# Altium project C210 Rev_D.PrjPcb (part 2 of 5)

## Sheet C210_0003_SARA_Module.SchDoc: C210_0003_SARA_Module
size B; Date: 2/26/2021; CompanyName: U-blox; DrawnBy: EMOO; Engineer: EMOO; Organization: U-blox; Address1: 2601 25th St. SE; Address2: Salem, OR 97302; SheetNumber: 3; SheetTotal: 7; Website: www.u-blox.com; SheetSize: B; SheetTitle: C-210 SARA Module
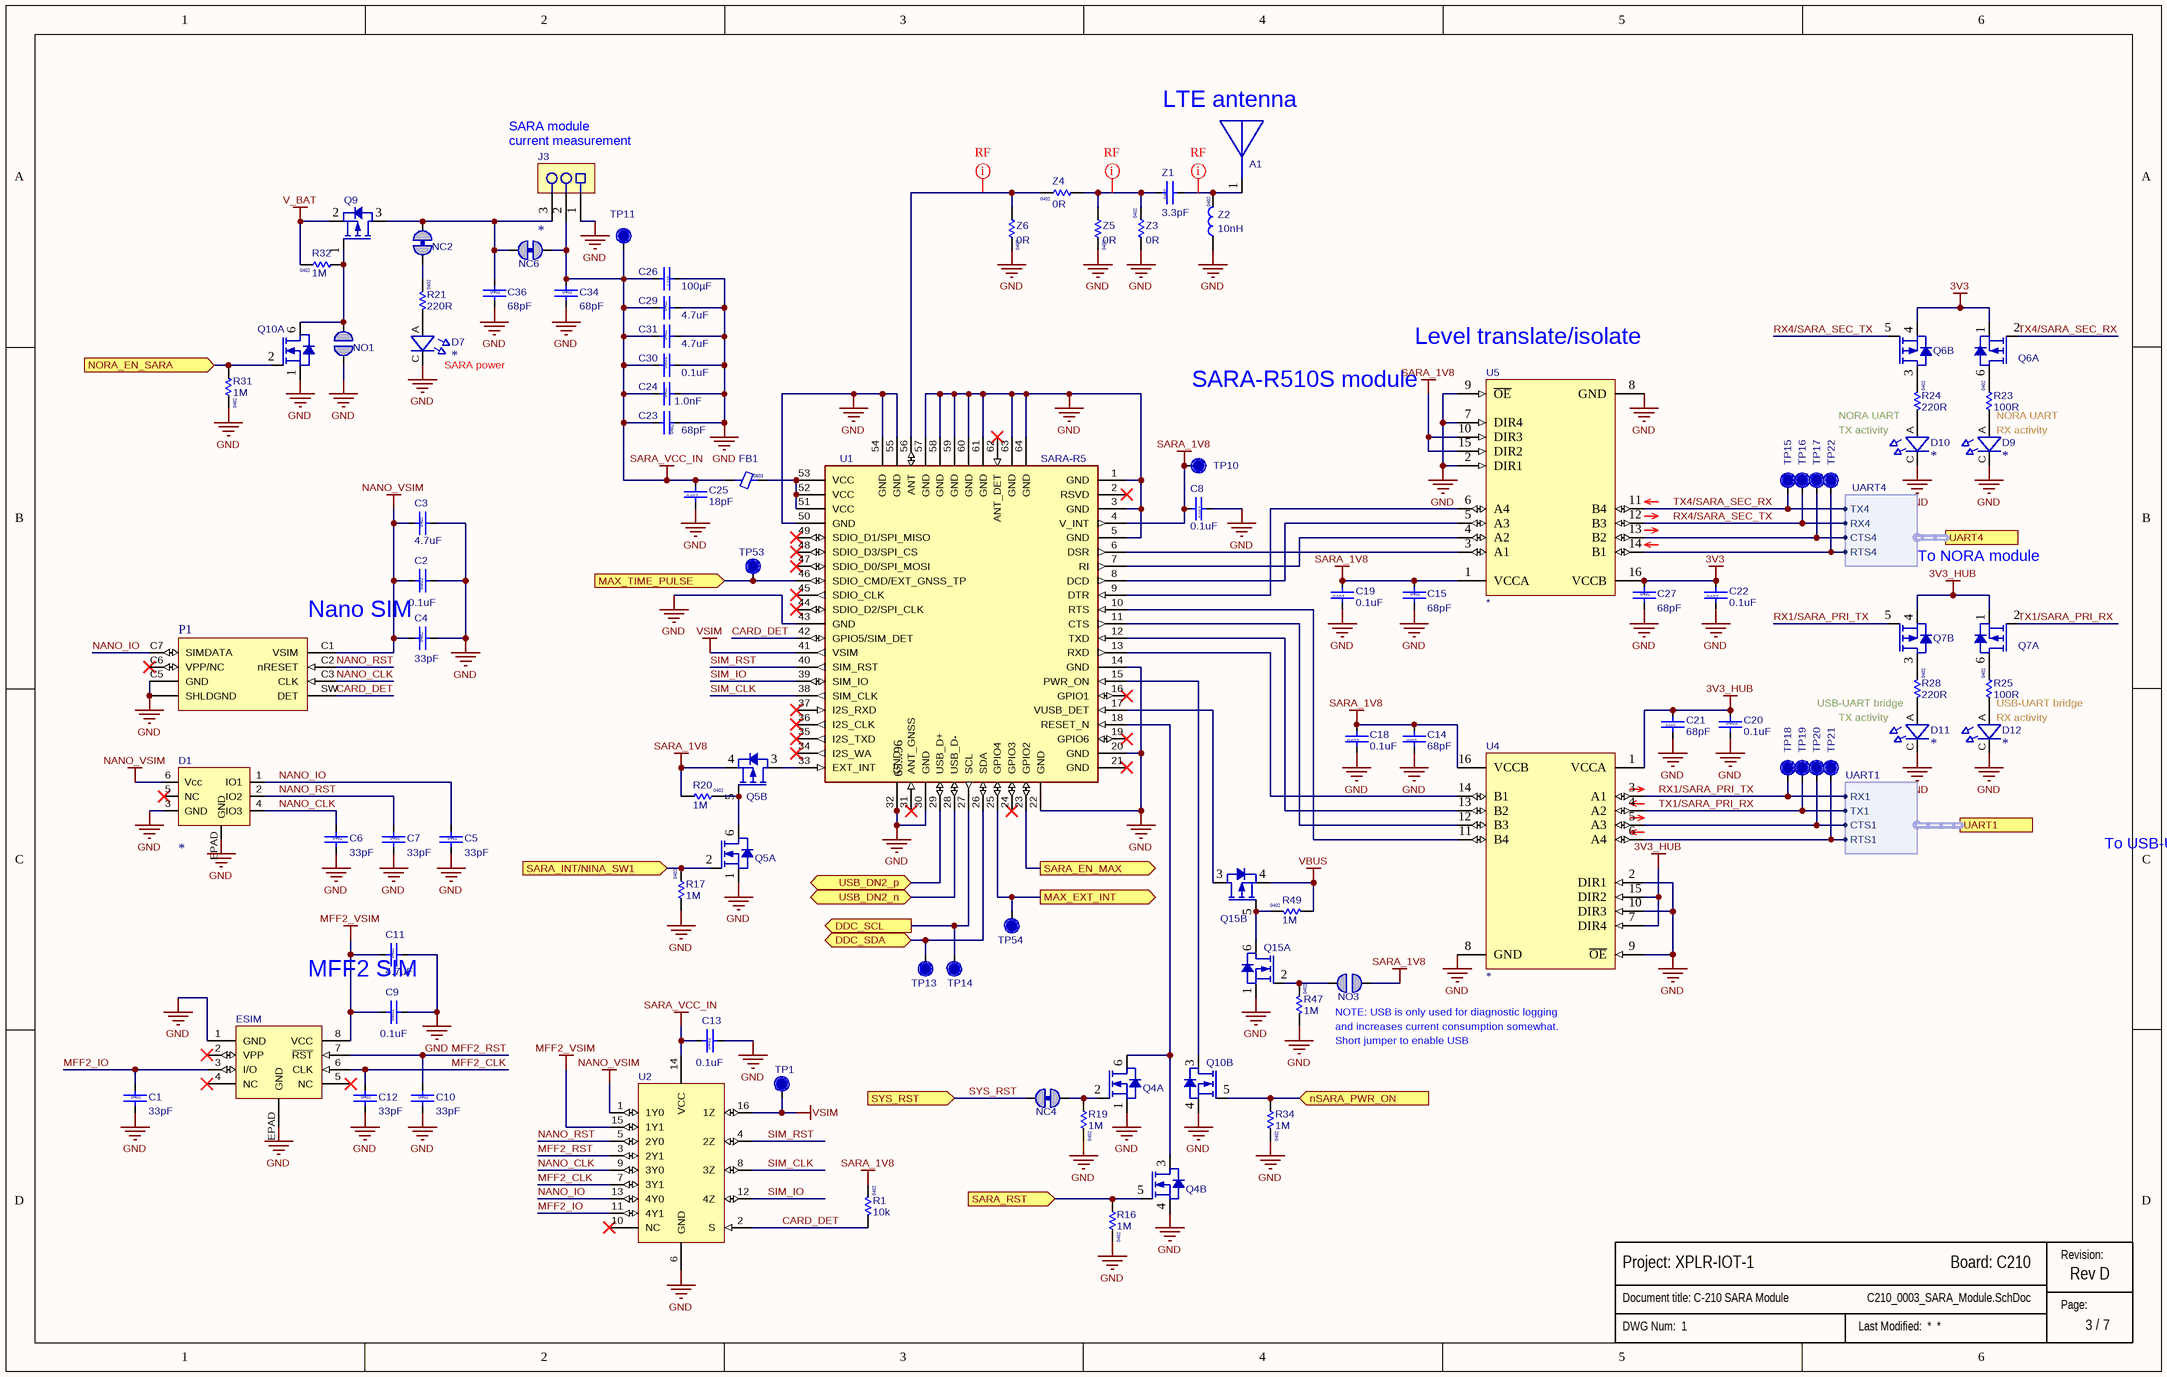
[diagram p2: C210_0003_SARA_Module.SchDoc]

### Parts
(Parts that share a designator on the sheet are numbered #1, #2 ... from top to bottom, then left to right.)
?#4  (no value)  (graphical)
A1  PCS.66.A  [PCS.66.A]  (value not drawn)
C1  value 33pF  Size: 0402  [Cap 0402 HD]
C2  value 0.1uF  Size: 0402  [Cap 0402 HD]  (hidden comment: 120-000160.1uF)
C3  value 4.7uF  Size: 0402  [Cap 0402 HD]
C4  value 33pF  Size: 0402  [Cap 0402 HD]
C5  value 33pF  Size: 0402  [Cap 0402 HD]
C6  value 33pF  Size: 0402  [Cap 0402 HD]
C7  value 33pF  Size: 0402  [Cap 0402 HD]
C8  value 0.1uF  Size: 0402  [Cap 0402 HD]  (hidden comment: 120-000160.1uF)
C9  value 0.1uF  Size: 0402  [Cap 0402 HD]  (hidden comment: 120-000160.1uF)
C10  value 33pF  Size: 0402  [Cap 0402 HD]
C11  value 4.7uF  Size: 0402  [Cap 0402 HD]
C12  value 33pF  Size: 0402  [Cap 0402 HD]
C13  value 0.1uF  Size: 0402  [Cap 0402 HD]  (hidden comment: 120-000160.1uF)
C14  value 68pF  Size: 0402  [Cap 0402 HD]
C15  value 68pF  Size: 0402  [Cap 0402 HD]
C18  value 0.1uF  Size: 0402  [Cap 0402 HD]  (hidden comment: 120-000160.1uF)
C19  value 0.1uF  Size: 0402  [Cap 0402 HD]  (hidden comment: 120-000160.1uF)
C20  value 0.1uF  Size: 0402  [Cap 0402 HD]  (hidden comment: 120-000160.1uF)
C21  value 68pF  Size: 0402  [Cap 0402 HD]
C22  value 0.1uF  Size: 0402  [Cap 0402 HD]  (hidden comment: 120-000160.1uF)
C23  value 68pF  Size: 0402  [Cap 0402 HD]
C24  value 1.0nF  Size: 0402  [Cap 0402 HD]
C25  value 18pF  Size: 0402  [Cap 0402 HD]
C26  value 100µF  Size: 1210  [Cap 1210]
C27  value 68pF  Size: 0402  [Cap 0402 HD]
C29  value 4.7uF  Size: 0402  [Cap 0402 HD]
C30  value 0.1uF  Size: 0402  [Cap 0402 HD]  (hidden comment: 120-000160.1uF)
C31  value 4.7uF  Size: 0402  [Cap 0402 HD]
C34  value 68pF  Size: 0402  [Cap 0402 HD]
C36  value 68pF  Size: 0402  [Cap 0402 HD]
D1  (no value)  [TPD3E001DRSR]
D7  (no value)  [LTST-C190EKT]
D9  (no value)  [LTST-C190YKT]
D10  (no value)  [LTST-C190KGKT]
D11  (no value)  [LTST-C190KGKT]
D12  (no value)  [LTST-C190YKT]
ESIM  (no value)  [MFF2 SIM]
FB1  Size: 0603  [BLM18EG221SN1]
J3  (no value)  [HDR-0.1P-3Pin-1Row-SMT]
NC2  Solderbridge-ShortDNP  [Solderbridge-Short]  (value not drawn)  (net tie, no BOM)
NC4  Solderbridge-ShortDNP  [Solderbridge-Short]  (value not drawn)  (net tie, no BOM)
NC6  Solderbridge-ShortDNP  [Solderbridge-Short]  (value not drawn)  (net tie, no BOM)
NO1  Solderbridge-OpenDNP  [Solderbridge-Open]  (value not drawn)  (no BOM)
NO3  Solderbridge-OpenDNP  [Solderbridge-Open]  (value not drawn)  (no BOM)
P1  (no value)  [G85D1160022HHR]
Q4  (no value)  [SOT-563]  (parts A,B of 2)
Q5  (no value)  [SOT-563]  (parts A,B of 2)
Q6  (no value)  [FDY2000PZ]  (parts A,B of 2)
Q7  (no value)  [FDY2000PZ]  (parts A,B of 2)
Q9  (no value)  [SOT-23]
Q10  (no value)  [SOT-563]  (parts A,B of 2)
Q15  (no value)  [SOT-563]  (parts A,B of 2)
R1  value 10k  Size: 0402  [RES 0402 HD]
R16  value 1M  Size: 0402  [RES 0402 HD]
R17  value 1M  Size: 0402  [RES 0402 HD]
R19  value 1M  Size: 0402  [RES 0402 HD]
R20  value 1M  Size: 0402  [RES 0402 HD]
R21  value 220R  Size: 0402  [RES 0402 HD]
R23  value 100R  Size: 0402  [RES 0402 HD]
R24  value 220R  Size: 0402  [RES 0402 HD]
R25  value 100R  Size: 0402  [RES 0402 HD]
R28  value 220R  Size: 0402  [RES 0402 HD]
R31  value 1M  Size: 0402  [RES 0402 HD]
R32  value 1M  Size: 0402  [RES 0402 HD]
R34  value 1M  Size: 0402  [RES 0402 HD]
R47  value 1M  Size: 0402  [RES 0402 HD]
R49  value 1M  Size: 0402  [RES 0402 HD]
TP1  TP  [TP12R]  (value not drawn)  (no BOM)
TP10  TP  [TP12R]  (value not drawn)  (no BOM)
TP11  TP  [TP12R]  (value not drawn)  (no BOM)
TP13  TP  [TP12R]  (value not drawn)  (no BOM)
TP14  TP  [TP12R]  (value not drawn)  (no BOM)
TP15  TP  [TP12R]  (value not drawn)  (no BOM)
TP16  TP  [TP12R]  (value not drawn)  (no BOM)
TP17  TP  [TP12R]  (value not drawn)  (no BOM)
TP18  TP  [TP12R]  (value not drawn)  (no BOM)
TP19  TP  [TP12R]  (value not drawn)  (no BOM)
TP20  TP  [TP12R]  (value not drawn)  (no BOM)
TP21  TP  [TP12R]  (value not drawn)  (no BOM)
TP22  TP  [TP12R]  (value not drawn)  (no BOM)
TP53  TP  [TP12R]  (value not drawn)  (no BOM)
TP54  TP  [TP12R]  (value not drawn)  (no BOM)
U1  SARA-R5  [SARA-XX]
U2  (no value)  [XQFN-16]
U4  (no value)  [QFN0.5P2x6-16Pin_W-Pad]
U5  (no value)  [QFN0.5P2x6-16Pin_W-Pad]
Z1  value 3.3pF  Size: 0402  [Cap 0402 HD]
Z2  value 10nH  Size: 0402  [IND 0402]
Z3  value 0R  Size: 0402  [RES 0402 HD]
Z4  value 0R  Size: 0402  [RES 0402 HD]
Z5  value 0R  Size: 0402  [RES 0402 HD]
Z6  value 0R  Size: 0402  [RES 0402 HD]

### Ports
DDC_SCL (out), DDC_SDA (bidir), MAX_EXT_INT (out), MAX_TIME_PULSE (in), NORA_EN_SARA (in), nSARA_PWR_ON (in), SARA_EN_MAX (out), SARA_INT/NINA_SW1 (in), SARA_RST (in), SYS_RST (in), UART1 (harness UART1), UART4 (harness UART4), USB_DN2_n (bidir), USB_DN2_p (bidir)

### Harnesses
UART4: TX4, RX4, RTS4, CTS4
UART1: TX1, RX1, RTS1, CTS1

### Nets
3V3: C22.2 C27.1 Q6.1(S1) Q6.4(S2) U5.16(VCCB)
3V3_HUB: C20.1 C21.2 Q7.1(S1) Q7.4(S2) U4.1(VCCA) U4.7(DIR4) U4.15(DIR2)
GND: C1.2 C2.2 C3.2 C4.2 C5.2 C6.2 C7.2 C8.1 C9.2 C10.2 C11.2 C12.2 C13.2 C14.1 C15.2 C18.1 C19.1 C20.2 C21.1 C22.1 C23.1 C24.2 C25.1 C26.1 C27.2 C29.2 C30.2 C31.2 C34.2 C36.2 D1.3(GND) D1.EPAD(GND) D7.C(Cathode) D9.C(Cathode) D10.C(Cathode) D11.C(Cathode) D12.C(Cathode) ESIM.1(GND) ESIM.EPAD(GND) J3.1 NO1.2 P1.C5(GND) P1.MP(SHLDGND) Q4.1(S1) Q4.4(S2) Q5.1(S1) Q10.1(S1) Q10.4(S2) Q15.1(S1) R16.2 R17.1 R19.2 R31.2 R34.2 R47.1 U1.1(GND) U1.3(GND) U1.5(GND) U1.14(GND) U1.20(GND) U1.22(GND) U1.30(GND) U1.32(GND) U1.43(GND) U1.50(GND) U1.54(GND) U1.55(GND) U1.57(GND) U1.58(GND) U1.59(GND) U1.60(GND) U1.61(GND) U1.63(GND) U1.64(GND) U1.65(GND) U1.66(GND) U1.67(GND) U1.68(GND) U1.69(GND) U1.70(GND) U1.71(GND) U1.72(GND) U1.73(GND) U1.74(GND) U1.75(GND) U1.76(GND) U1.77(GND) U1.78(GND) U1.79(GND) U1.80(GND) U1.81(GND) U1.82(GND) U1.83(GND) U1.84(GND) U1.85(GND) U1.86(GND) U1.87(GND) U1.88(GND) U1.89(GND) U1.90(GND) U1.91(GND) U1.92(GND) U1.93(GND) U1.94(GND) U1.95(GND) U1.96(GND) U2.6(GND) U4.2(DIR1) U4.8(GND) U4.9(~{OE}) U4.10(DIR3) U5.2(DIR1) U5.7(DIR4) U5.8(GND) U5.9(~{OE}) Z2.1 Z3.1 Z5.2 Z6.2
MFF2_VSIM: C9.1 C11.1 ESIM.8(VCC) U2.15(1Y1)
NANO_VSIM: C2.1 C3.1 C4.1 D1.6(Vcc) P1.C1(VSIM) U2.1(1Y0)
SARA_1V8: C8.2 C14.2 C15.1 C18.2 C19.2 NO3.2 Q5.4(S2) R1.2 R20.1 TP10.1 U1.4(V_INT) U4.16(VCCB) U5.1(VCCA) U5.10(DIR3) U5.15(DIR2)
SARA_VCC_IN: C13.1 C23.2 C24.1 C25.2 C26.2 C29.1 C30.1 C31.1 C34.1 FB1.1 J3.2 NC6.1 TP11.1 U2.14(VCC)
V_BAT: Q9.2(S) R32.2
VBUS: Q15.4(S2) R49.1
VSIM: TP1.1 U1.41(VSIM) U2.16(1Z)
CARD_DET: P1.SW(DET) R1.1 U1.42(GPIO5/SIM_DET) U2.2(S)
CTS4: TP17.1 U5.13(B2) ; port UART4.CTS4
MFF2_CLK: C12.1 ESIM.6(CLK) U2.7(3Y1)
MFF2_IO: C1.1 ESIM.3(I/O) U2.11(4Y1)
MFF2_RST: C10.1 ESIM.7(~{RST}) U2.3(2Y1)
NANO_CLK: C6.1 D1.4(IO3) P1.C3(CLK) U2.9(3Y0)
NANO_IO: C5.1 D1.1(IO1) P1.C7(SIMDATA) U2.13(4Y0)
NANO_RST: C7.1 D1.2(IO2) P1.C2(nRESET) U2.5(2Y0)
RTS4: TP22.1 U5.14(B1) ; port UART4.RTS4
RX1/SARA_PRI_TX: Q7.5(G2) TP18.1 U4.3(A1) ; port UART1.RX1
RX4/SARA_SEC_TX: Q6.5(G2) TP16.1 U5.12(B3) ; port UART4.RX4  [project net RX4]
SIM_CLK: U1.38(SIM_CLK) U2.8(3Z)
SIM_IO: U1.39(SIM_IO) U2.12(4Z)
SIM_RST: U1.40(SIM_RST) U2.4(2Z)
SYS_RST: NC4.2 ; port SYS_RST
TX1/SARA_PRI_RX: Q7.2(G1) TP19.1 U4.4(A2) ; port UART1.TX1
TX4/SARA_SEC_RX: Q6.2(G1) TP15.1 U5.11(B4) ; port UART4.TX4  [project net TX4]
USB_DN2_n: U1.28(USB_D-) ; port USB_DN2_n
USB_DN2_p: U1.29(USB_D+) ; port USB_DN2_p
NetA1_1: A1.1 Z1.2 Z2.2
NetC36_1: C36.1 J3.3 NC2.1 NC6.2 Q9.3(D)
NetD7_A: D7.A(Anode) R21.1
NetD9_A: D9.A(Anode) R23.1
NetD10_A: D10.A(Anode) R24.1
NetD11_A: D11.A(Anode) R28.1
NetD12_A: D12.A(Anode) R25.1
NetFB1_2: FB1.2 U1.51(VCC) U1.52(VCC) U1.53(VCC)
NetNC2_2: NC2.2 R21.2
NetNC4_1: NC4.1 Q4.2(G1) R19.1
NetNO1_1: NO1.1 Q9.1(G) Q10.6(D1) R32.1
NetNO3_1: NO3.1 Q15.2(G1) R47.2
NetQ1_2: Q5.2(G1) R17.2 ; port SARA_INT/NINA_SW1
NetQ4_3: Q4.3(D2) Q4.6(D1) U1.18(RESET_N)
NetQ4_5: Q4.5(G2) R16.1 ; port SARA_RST
NetQ5_3: Q5.3(D2) U1.33(EXT_INT)
NetQ5_5: Q5.5(G2) Q5.6(D1) R20.2
NetQ6_3: Q6.3(D2) R24.2
NetQ6_6: Q6.6(D1) R23.2
NetQ7_3: Q7.3(D2) R28.2
NetQ7_6: Q7.6(D1) R25.2
NetQ10_2: Q10.2(G1) R31.1 ; port NORA_EN_SARA
NetQ10_3: Q10.3(D2) U1.15(PWR_ON)
NetQ10_5: Q10.5(G2) R34.1 ; port nSARA_PWR_ON
NetQ15_3: Q15.3(D2) U1.17(VUSB_DET)
NetQ15_5: Q15.5(G2) Q15.6(D1) R49.2
NetQ27_2: U1.23(GPIO2) ; port SARA_EN_MAX
NetR18_2: TP53.1 U1.46(SDIO_CMD/EXT_GNSS_TP) ; port MAX_TIME_PULSE
NetTP13_1: TP13.1 U1.26(SDA) ; port DDC_SDA
NetTP14_1: TP14.1 U1.27(SCL) ; port DDC_SCL
NetTP20_1: TP20.1 U4.5(A3) ; port UART1.CTS1
NetTP21_1: TP21.1 U4.6(A4) ; port UART1.RTS1
NetTP54_1: TP54.1 U1.25(GPIO4) ; port MAX_EXT_INT
NetU1_6: U1.6(DSR) U5.3(A1)
NetU1_7: U1.7(RI) U5.4(A2)
NetU1_8: U1.8(DCD) U5.5(A3)
NetU1_9: U1.9(DTR) U5.6(A4)
NetU1_10: U1.10(RTS) U4.11(B4)
NetU1_11: U1.11(CTS) U4.12(B3)
NetU1_12: U1.12(TXD) U4.13(B2)
NetU1_13: U1.13(RXD) U4.14(B1)
NetU1_56: U1.56(ANT) Z4.2 Z6.1
NetZ1_1: Z1.1 Z3.2 Z4.1 Z5.1

Not connected (* = marked no-connect by the designer): D1 5(NC)*; ESIM 2(VPP)* 4(NC)* 5(NC)*; P1 C6(VPP/NC)*; U1 2(RSVD)* 16(GPIO1)* 19(GPIO6)* 21(GND)* 24(GPIO3)* 31(ANT_GNSS)* 34(I2S_WA)* 35(I2S_TXD)* 36(I2S_CLK)* 37(I2S_RXD)* 44(SDIO_D2/SPI_CLK)* 45(SDIO_CLK)* 47(SDIO_D0/SPI_MOSI)* 48(SDIO_D3/SPI_CS)* 49(SDIO_D1/SPI_MISO)* 62(ANT_DET)*; U2 10(NC)*

### Layout directives
net class RF: NetA1_1, NetU1_56, NetZ1_1

### Notes on the sheet
- LTE antenna
- SARA module
- (near J3) current measurement
- (near D7) SARA power
- SARA-R510S module
- (near U5) Level translate/isolate
- TX activity
- NORA UART
- (near D9) RX activity
- (near R23) NORA UART
- To NORA module
- (near P1) Nano SIM
- USB-UART bridge
- (near D12) RX activity
- (near R25) USB-UART bridge
- To USB-UART bridge
- MFF2 SIM
- NOTE: USB is only used for diagnostic logging
- and increases current consumption somewhat.
- Short jumper to enable USB
- Revision:
- Page:
- (in symbol SARA-R5) 65...96

### Library data of the parts
?#4 = Sub_Title_Block: as ?#3 on sheet C210_0002_NORA_Module
A1 = PCS.66.A: RF Passive, Antenna, LTE, 600-6000MHz, Monopole; Manufacturer 1: Taoglas; Body Size: 33mm x 25mm; Item Phase: Unreleased; MFG Package: Custom; RF Freq: 698-2700 MHz; SMT Pitch: None; Use in new designs: Yes; Part Number: PCS.66.A; Manufacturer Part Number 1: PCS.66.A; Height: 1.6mm; Max Operating Temp: 85; Min Operating Temp: -40; Pins: 5; Revision: None; Size: Other; Voltage: None; UBX Code: None; Manufacturer 2: None; Manufacturer Part Number 2: None; Supplier 2: None; Supplier Part Number 2: None
C1 C4-C7 C10 C12 = 120-00045: Cap, Ceramic,  33pF, 50V, 5%, NPO, 0402; Manufacturer 1: Samsung Electro-Mechanics America, Inc; Manufacturer Part Number 1: CL05C330JB5NNNC; Part Name: CAP CER 33PF 50V 5% NP0 0402; Item Phase: In Production; Temperature Coefficient: NP0; Tolerance: +/- 5%; Use in new designs: Yes; UBX Code: None; Part Number: 120-00045; Supplier 1: Digi-Key; Supplier Part Number 1: 1276-1272-1-ND; Manufacturer 2: Murata Electronics North America; Manufacturer Part Number 2: GRM1555C1H330JA01D; Supplier 2: Digi-Key; Supplier Part Number 2: 490-5936-1-ND; Height: 0.55mm; Max Operating Temp: 125; Min Operating Temp: -55; Pins: 2; Revision: 0A; Voltage: 50V
C2 C8 C9 C13 C18-C20 C22 C30 = 120-00016: as C39 on sheet C210_0002_NORA_Module; Part Number: 120-00016; Revision: 0A; Supplier 1: Digi-Key; Supplier Part Number 1: 490-6297-1-ND; Manufacturer 2: Yageo; Manufacturer P/N 2: CC0402KRX5R6BB104; Supplier 2: Digi-Key; Supplier Part Number 2: 311-1336-1-ND; Arena Link: https://app.bom.com/a/GYHPV2L2L43KRMBK?v=spec.summary; Height: 0.55mm; Pins: 2; Temperature Coefficient: X5R; Voltage: 10V
C3 C11 C29 C31 = 120-00020: Cap, Ceramic 4.7uF 10V 20% X5R 0402; Manufacturer 1: Samsung Electro-Mechanics America, Inc; Manufacturer Part Number 1: CL05A475MP5NRNC; Part Name: CAP CER 4.7uF 10V 20% X5R 0402; Item Phase: In Production; Tolerance: +/- 20%; Use in new designs: Yes; UBX Code: None; Part Number: 120-00020; Supplier 1: Digi-Key; Supplier Part Number 1: 1276-1482-1-ND; Manufacturer 2: Yageo; Manufacturer Part Number 2: CC0402KRX5R6BB475; Supplier 2: Digi-Key; Supplier Part Number 2: 311-3477-1-ND; Height: 0.55mm; Max Operating Temp: 85; Min Operating Temp: -55; Pins: 2; Revision: 0C; Temperature Coefficient: X5R; Voltage: 10V
C14 C15 C21 C23 C27 C34 C36 = 120-00047: as C82 on sheet C210_0002_NORA_Module; Part Number: 120-00047; Supplier 1: Digi-Key; Supplier Part Number 1: 490-8219-1-ND; Manufacturer 2: AVX Corporation; Manufacturer Part Number 2: 04025A680FAT2A; Supplier 2: Digi-Key; Supplier Part Number 2: 478-7881-1-ND; Height: 0.55mm; Max Operating Temp: 125; Min Operating Temp: -55; Pins: 2; Revision: None; Temperature Coefficient: NP0; Voltage: 50V
C24 = 120-00010: CAP CER 1.0nF 50V 10% X7R 0402; Manufacturer 1: TDK Corporation; Manufacturer Part Number 1: C1005X7R1H102K050BE; Item Phase: In Production; Tolerance: +/- 10%; Use in new designs: Yes; UBX Code: None; Part Number: 120-00010; Supplier 1: Digi-Key; Supplier Part Number 1: 445-173622-1-ND; Manufacturer 2: Kemet; Manufacturer Part Number 2: C0402C102K5RACTU; Supplier 2: Digi-Key; Supplier Part Number 2: 399-1032-1-ND; Height: 0.55mm; Max Operating Temp: 125; Min Operating Temp: -55; Part Name: CAP CER 1.0NF 50V 10% X7R 0402; Pins: 2; Revision: 0D; Temperature Coefficient: X7R; Voltage: 50V
C25 = 120-00041: Cap, Ceramic 18pF 50V 5% NP0 0402; Manufacturer 1: NIC Components Inc; Manufacturer Part Number 1: NMC0402NPO180J50TRPF; Part Name: CAP CER 18PF 50V 5% NP0 0402; Item Phase: In Production; Tolerance: +/- 5%; Use in new designs: Yes; UBX Code: None; Part Number: 120-00041; Supplier 1: Arrow; Supplier Part Number 1: NMC0402NPO180J50TRPF; Manufacturer 2: CCK; Manufacturer Part Number 2: CCK0402NPO5J180PL; Supplier 2: None; Supplier Part Number 2: None; Height: 0.55mm; Max Operating Temp: 125; Min Operating Temp: -55; Pins: 2; Revision: 0C; Temperature Coefficient: NP0; Voltage: 50V
C26 = 120-00223: 100µF ±20% 10V Ceramic Capacitor X5R 1210 (3225 Metric); Manufacturer 1: Samsung Electro-Mechanics America, Inc.; Manufacturer Part Number 1: CL32A107MPVNNNE; Part Name: CAP CER 100UF 10V 20% X5R 1210; Item Phase: In Production; Tolerance: +/- 20%; Use in new designs: Yes; UBX Code: None; Part Number: 120-00223; Supplier 1: Future Electronics; Supplier Part Number 1: Samsung Electro-Mechanics America, Inc. CL32A107MPVNNNE; Manufacturer 2: None; Manufacturer Part Number 2: None; Supplier 2: None; Supplier Part Number 2: None; Height: 2.8mm; Max Operating Temp: 85; Min Operating Temp: -55; Pins: 2; Revision: 0A; Temperature Coefficient: X5R; Voltage: 10V
D1 = TPD3E001: TVS Diode, ESD High Speed 3-Channel Array, WSON-6, 3mmX3mm; Manufacturer 1: Texas Instruments; Part Name: Diode TVS 5V 3CH WSON-6; Current: None; Item Phase: In Production; MFG Package: WSON-6, DRS (S-PWSON-N6); Use in new designs: Yes; Voltage: 5.5V; Manufacturer Part Number 1: TPD3E001DRSR; Manufacturer 2: None; Manufacturer Part Number 2: None; Supplier 2: None; Supplier Part Number 2: None; Body Size: 3mm x 3mm; Height: 0.80mm; Max Operating Temp: 85; Min Operating Temp: -40; Pins: 6; Revision: 0A; UBX Code: None; Manufacturer P/N: *
D7 = LTST-C190EKT: DIODE, LED, SMT, Red, CLEAR LENS, 2.0V 10mA, 0603; Manufacturer 1: Lite-On Inc; Part Name: LED Red SMT 0603; Body Size: 1.60mm x 0.80mm; Item Phase: In Production; MFG Package: None; Use in new designs: Yes; Part Number: LTST-C190EKT; Manufacturer Part Number 1: LTST-C190EKT; Supplier 1: Digi-Key; Supplier Part Number 1: 160-1182-2-ND; Current: 10mA; Height: 0.80mm; Max Operating Temp: 85; Min Operating Temp: -30; Pins: 2; Revision: 0A; Size: 0603; Voltage: 2.0V; UBX Code: None; Manufacturer 2: None; Manufacturer Part Number 2: None; Supplier 2: None; Supplier Part Number 2: None; Color: *
D9 D12 = LTST-C190YKT: as D14 on sheet C210_0002_NORA_Module; Part Number: LTST-C190YKT; Manufacturer Part Number 1: LTST-C190YKT; Supplier 1: Digi-Key; Supplier Part Number 1: 160-1184-2-ND; Current: 10mA; Height: 0.80mm; Max Operating Temp: 85; Min Operating Temp: -30; Pins: 2; Revision: 0A; Size: 0603; Voltage: 2.1V; UBX Code: None; Manufacturer 2: None; Manufacturer Part Number 2: None; Supplier 2: None; Supplier Part Number 2: None; Color: *
D10 D11 = LTST-C190KGKT: as D13 on sheet C210_0002_NORA_Module; Manufacturer Part Number 1: LTST-C190KGKT; Supplier 1: Digi-Key; Supplier Part Number 1: 160-1435-2-ND; Current: 20mA; Height: 0.80mm; Max Operating Temp: 85; Min Operating Temp: -30; Pins: 2; Revision: 0A; Size: 0603; Voltage: 2.0V; UBX Code: None; Manufacturer 2: None; Manufacturer Part Number 2: None; Supplier 2: None; Supplier Part Number 2: None; Color: *
ESIM = MFF2 SIM: ESIM, SMT, MFF2, 1.8V, SMT, VFDFPN8, 5mmX6mm; Manufacturer 1: Thingstream; Manufacturer Part Number 1: MFF2 ESIM; Current: None; Item Phase: In Production; Use in new designs: Yes; Part Number: MFF2 SIM; Body Size: 5mm x 6mm; Height: 1mm; MFG Package: VFDFPN8; Max Operating Temp: 85; Min Operating Temp: -40; Part Name: ESIM; Pins: 12; Revision: 0A; Voltage: 1.8V; UBX Code: None
FB1 = BLM18EG221SN1: Ferrite Bead, 220ohm @ 100MHz, 2A, 0603; Manufacturer 1: Murata Electronics North America; Manufacturer Part Number 1: BLM18EG221SN1D; Part Name: Ferrite Bead 220ohm 2A 0503; Body Size: None; Item Phase: Unreleased; Use in new designs: Yes; Value: None; Part Number: BLM18EG221SN1; Supplier 1: Digi-Key; Supplier Part Number 1: 490-3992-2-ND; Current: 2A; Height: 0.8mm; MFG Package: None; Max Operating Temp: 85; Min Operating Temp: -55; Pins: None; Revision: None; Voltage: None; Manufacturer 2: None; Manufacturer Part Number 2: None; Supplier 2: None; Supplier Part Number 2: None; UBX Code: None
J3 = 130-00105: as J4 on sheet C210_0002_NORA_Module; Manufacturer P/N: *; Part Number: 130-00105; Supplier 1: Digi-Key; Supplier Part Number 1: 952-1951-ND; Diameter: None; Height: 9.93mm; Max Operating Temp: None; Min Operating Temp: None; Pins: 3; Revision: 0C; UBX Code: None; Manufacturer 2: Greenconn Corporation; Manufacturer Part Number 2: GPHC1010302A081B1BD; Supplier 2: Teamwise Limited; Supplier Part Number 2: Greenconn Corporation GPHC1010302A081B1BD
NC2 NC4 NC6 = Solderbridge-Short: Added By: Paul B; Part Number: Solderbridge-Short; Height: 0; DNP: DNP; Added Date: 12/2/2015
NO1 NO3 = Solderbridge-Open: Added By: Paul B; Part Number: Solderbridge-Open; Height: 0; DNP: DNP; Added Date: 12/2/2015
P1 = G85D1160022HHR: NANO SIM SOCKET, SWITCH, SMT, HINGED, 13mmX14mm; Manufacturer 1: Amphenol ICC; Current: 1A; Item Phase: In Production; MFG Package: Custom; Use in new designs: Yes; Voltage: 5V; UBX Code: None; Part Number: G85D1160022HHR; Manufacturer Part Number 1: G85D1160022HHR; Body Size: 13mm x 14mm; Height: 1.4mm; Max Operating Temp: 85; Min Operating Temp: -40; Part Name: G85D1160022HHR; Pins: 11; Revision: 0A
Q4 Q10 = 140-00016: as Q16 on sheet C210_0002_NORA_Module; Part Number: 140-00016; Supplier 1: Digi-Key; Supplier Part Number 1: SSM6N56FELMCT-ND; Height: 0.6mm; MFG Package: SOT-563; Max Operating Temp: 150; Min Operating Temp: -55; Pins: 6; Revision: 0A; Voltage: 20V; Manufacturer 2: None; Manufacturer Part Number 2: None; Supplier 2: None; Supplier Part Number 2: None
Q5 Q15 = 140-00030: as Q18 on sheet C210_0002_NORA_Module; Part Number: 140-00030; Supplier 1: Digi-Key; Supplier Part Number 1: NTZD3155CT2GOSCT-ND; Current: 540 mA, −430 mA; Height: 0.6mm; MFG Package: SOT-563; Max Operating Temp: 150; Min Operating Temp: -55; Part Name: MOSFET N/P-CH 20V SOT-563; Pins: 6; Revision: 0A; Voltage: 20V; Manufacturer 2: None; Manufacturer Part Number 2: None; Supplier 2: None; Supplier Part Number 2: None
Q6 Q7 = FDY2000PZ: as Q12 on sheet C210_0002_NORA_Module; Part Number: FDY2000PZ; Manufacturer Part Number 1: FDY2000PZ; Supplier 1: Digi-Key; Supplier Part Number 1: 2156-FDY2000PZ-ND; Current: -350mA; Height: 0.6mm; MFG Package: SOT-563; Max Operating Temp: 150; Min Operating Temp: -55; Part Name: MOSFET DUAL P-CH 20V SOT-563; Pins: 6; Revision: 0A; Voltage: 20V; Manufacturer 2: Diodes, Inc.; Manufacturer Part Number 2: DMP2004VK-7; Supplier 2: None; Supplier Part Number 2: None
Q9 = 140-00008: P-MOSFET, 20V 3.1A, SOT-23; Manufacturer 1: Vishay Siliconix; Manufacturer Part Number 1: SI2301CDS-T1-GE3; Part Name: Si2301CDS; Body Size: None; Item Phase: In Production; Transistor Type: P-Channel; MFG Package: SOT23; Use in new designs: Yes; Part Number: 140-00008; Supplier 1: Digi-Key; Supplier Part Number 1: SI2301CDS-T1-GE3CT-ND; Current: 3.1A; Height: None; Max Operating Temp: 150; Min Operating Temp: -55; Pins: 3; Revision: 0B; Thermal Pad: None; Voltage: 20V; UBX Code: None; Manufacturer 2: None; Manufacturer Part Number 2: None; Supplier 2: None; Supplier Part Number 2: None
R1 = 180-00024: Resistor 10k ohm 1% 1/16W, 0402; Manufacturer 1: Samsung Electro-Mechanics America, Inc; Manufacturer Part Number 1: RC1005F103CS; Part Name: RES SMD 10K OHM 1% 1/16W 0402; Item Phase: In Production; Tolerance: +/- 1%; Use in new designs: Yes; UBX Code: None; Part Number: 180-00024; Supplier 1: Digi-Key; Supplier Part Number 1: 1276-3431-1-ND; Manufacturer 2: Hong Kong Resistors Manufactory; Manufacturer Part Number 2: RCT0210KFLF; Supplier 2: None; Supplier Part Number 2: None; Height: 0.4mm; Max Operating Temp: 155; Min Operating Temp: -55; Pins: 2; Power: 1/16W; Revision: 0E; Voltage: N/A
R16 R17 R19 R20 R31 R32 R34 R47 R49 = 180-00054: as R60 on sheet C210_0002_NORA_Module; Part Number: 180-00054; Supplier 1: Digi-Key; Supplier Part Number 1: 1276-3433-1-ND; Manufacturer 2: Hong Kong Resistors Manufactory; Manufacturer Part Number 2: RCT021MFLF; Supplier 2: None; Supplier Part Number 2: None; Height: 0.4mm; Max Operating Temp: 155; Min Operating Temp: -55; Pins: 2; Power: 1/16W; Revision: 0D; UBX Code: None
R21 R24 R28 = 180-00098: as R38 on sheet C210_0002_NORA_Module; Part Number: 180-00098; Part_Type: Resistor; Supplier 1: Digi-Key; Supplier Part Number 1: P220JCT-ND; Arena Link: https://app.bom.com/a/8Q9HNUDUDWVBJC30?v=spec.summary; Pins: 2; Power: 1/16W; Revision: 0C; Manufacturer 2: Samsung Electro-Mechanics America, Inc; Manufacturer P/N 2: RC1005J221CS; Supplier 2: Digi-Key; Supplier Part Number 2: 1276-4360-1-ND; Alternate Footprint Ref: RES 0402; Height: 0.4mm
R23 R25 = 180-00051: as R39 on sheet C210_0002_NORA_Module; Part Number: 180-00051; Supplier 1: None; Supplier Part Number 1: None; Manufacturer 2: Stackpole Electronics Inc.; Manufacturer Part Number 2: RMCF0402FT100R; Supplier 2: Digi-Key; Supplier Part Number 2: RMCF0402FT100RCT-ND; Height: 0.4mm; Max Operating Temp: 155; Min Operating Temp: -55; Pins: 2; Power: 1/16W; Revision: 0E; UBX Code: None
TP1 TP10 TP11 TP13-TP22 TP53 TP54 = TP_R: as TP23 on sheet C210_0002_NORA_Module; Size: 1.0mm; Height: 0; DNP: DNP; Added Date: 2/1/2015; Checked By: Paul B; Checked Date: 2/5/2015
U1 = SARA-R5: GSM/GPRS and GSM/EGPRS/HSPA Cellular Module; Manufacturer: u-blox; Part Description: GSM/EGPRS/HSPA module; Manufacturer Part Number 1: SARA-R510S-01B-00; Value: SARA-R5; Manufacturer 1: u-blox
U2 = NX3DV2567: IC, ANLG SWITCH, 4PDT, SIM OPTIMIZED, 1.4V-4.3V, SMT, XQFN-16, 2.6mmX1.8mm; Manufacturer 1: NXP USA Inc.; Manufacturer Part Number 1: NX3DV2567GU,115; Current: None; Item Phase: In Production; Use in new designs: Yes; Part Number: NX3DV2567; Body Size: 2.6mm x 1.8mm; Height: 1mm; MFG Package: XQFN-16; Max Operating Temp: 85; Min Operating Temp: -40; Part Name: NX3DV2567GU,115; Pins: 16; Revision: 0A; Voltage: 1.4V-4.3V; UBX Code: None
U4 U5 = 225-00011: as U9 on sheet C210_0002_NORA_Module; Manufacturer P/N: *; Part Number: 225-00011; Supplier 1: Digi-Key; Supplier Part Number 1: 568-9220-1-ND; Height: 1mm; Logic Type: Level Translator; MFG Package: 16-DHVQFN; Max Operating Temp: 125; Min Operating Temp: -40; Pins: 16; Revision: 0B; Use in new designs: Yes; Manufacturer 2: ON Semiconductor; Manufacturer Part Number 2: FXL4TD245BQX; Supplier 2: Digi-Key; Supplier Part Number 2: FXL4TD245BQXCT-ND
Z1 = 120-00079: CAP CER 3.3PF 50V +/-0.25pF NP0 0402; Manufacturer 1: Murata Electronics North America; Manufacturer Part Number 1: GRM1555C1H3R3CA01D; Item Phase: In Production; Tolerance: Other; Use in new designs: Yes; UBX Code: None; Part Number: 120-00079; Supplier 1: Digi-Key; Supplier Part Number 1: 490-5938-1-ND; Manufacturer 2: Samsung Electro-Mechanics America, Inc; Manufacturer Part Number 2: CL05C3R3CB5NNNC; Supplier 2: Digi-Key; Supplier Part Number 2: 1276-1141-1-ND; Height: 0.55mm; Max Operating Temp: 125; Min Operating Temp: -55; Part Name: CAP CER 3.3PF 50V +/-0.25pF NP0 0402; Pins: 2; Revision: 0A; Temperature Coefficient: NP0; Voltage: 50V
Z2 = 150-00010: INDUCTOR 10NH 300MA 0402; Manufacturer 1: Murata Electronics North America; Manufacturer Part Number 1: LQG15HS10NJ02D; Body Size: None; Item Phase: In Production; Tolerance: +/- 5%; Use in new designs: Yes; Part Number: 150-00010; Supplier 1: Digi-Key; Supplier Part Number 1: 490-2623-1-ND; Current: None; Height: 0.55mm; Isat: 300mA; Max Operating Temp: 125; Min Operating Temp: -55; Part Name: INDUCTOR 10NH 300MA 0402; Pins: 2; Revision: 0A; Voltage: None; UBX Code: None; Manufacturer 2: None; Manufacturer Part Number 2: None; Supplier 2: None; Supplier Part Number 2: None
Z3-Z6 = 180-00020: Resistor 0 ohm 1/16W 0402; Manufacturer 1: Yageo; Manufacturer Part Number 1: RC0402FR-070RL; Part Name: RES SMD 0.0 OHM JUMPER 1/16W 0402; Item Phase: In Production; Tolerance: None; Use in new designs: Yes; Part Number: 180-00020; Supplier 1: Digi-Key; Supplier Part Number 1: 311-0.0LRCT-ND; Manufacturer 2: Hong Kong Resistors Manufactory; Manufacturer Part Number 2: RCT020RLF; Supplier 2: None; Supplier Part Number 2: None; Height: 0.40mm; Max Operating Temp: 155; Min Operating Temp: -55; Pins: 2; Power: 1/16W; Revision: 0E; Voltage: N/A; UBX Code: None